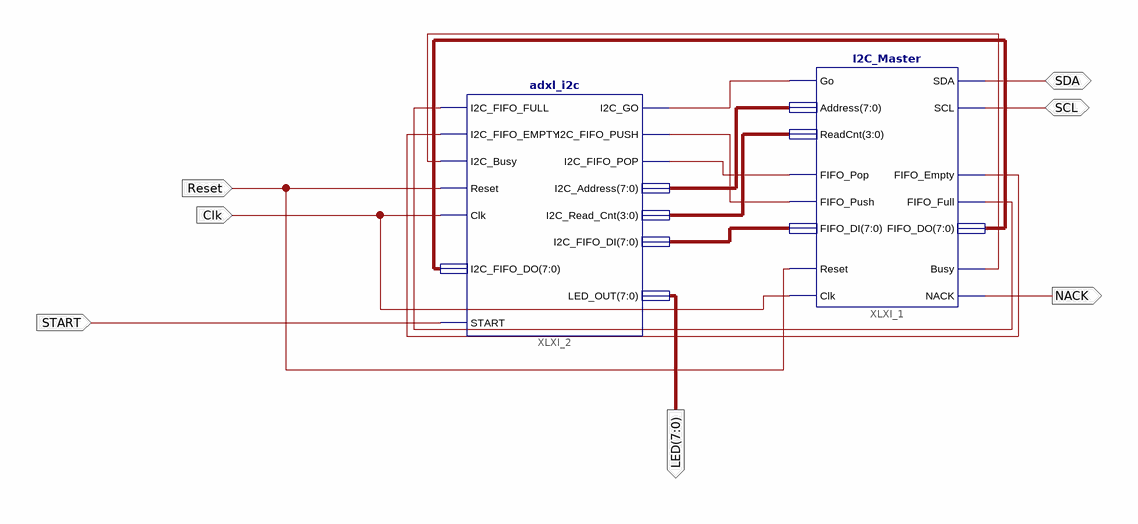
[diagram p0: schematic sheet 1]
// Xilinx ISE schematic top.sch (spartan3e) as structural Verilog: 2 symbols, 7 ports
module top (
  input  Clk,
  input  Reset,
  input  START,
  inout  SDA,
  inout  SCL,
  output NACK,
  output [7:0] LED
);

  wire XLXN_1, XLXN_2, XLXN_3, XLXN_7, XLXN_8, XLXN_10;
  wire [3:0] XLXN_5;
  wire [7:0] XLXN_4, XLXN_6, XLXN_9;

  I2C_Master XLXI_1 (
    .Go(XLXN_1), .Address(XLXN_4), .ReadCnt(XLXN_5), .SDA(SDA), .SCL(SCL), .FIFO_Pop(XLXN_3),
    .FIFO_Push(XLXN_2), .FIFO_DI(XLXN_6), .FIFO_Empty(XLXN_7), .FIFO_Full(XLXN_8), .FIFO_DO(XLXN_9),
    .Reset(Reset), .Clk(Clk), .Busy(XLXN_10), .NACK(NACK));
  adxl_i2c XLXI_2 (
    .START(START), .I2C_FIFO_FULL(XLXN_8), .I2C_FIFO_EMPTY(XLXN_7), .I2C_Busy(XLXN_10), .Reset(Reset),
    .Clk(Clk), .I2C_FIFO_DO(XLXN_9), .I2C_GO(XLXN_1), .I2C_FIFO_PUSH(XLXN_2), .I2C_FIFO_POP(XLXN_3),
    .I2C_Address(XLXN_4), .I2C_Read_Cnt(XLXN_5), .I2C_FIFO_DI(XLXN_6), .LED_OUT(LED));
endmodule
